# EasyEDA schematic loud-esp-rev-f-schematic.easyeda.json

## Sheets
1 MCU: TITLE: ESP32 audio development board; REV: F1; Date: 2023-04-20; Sheet: 1/5; Drawn By: andriy@sonocotta.com
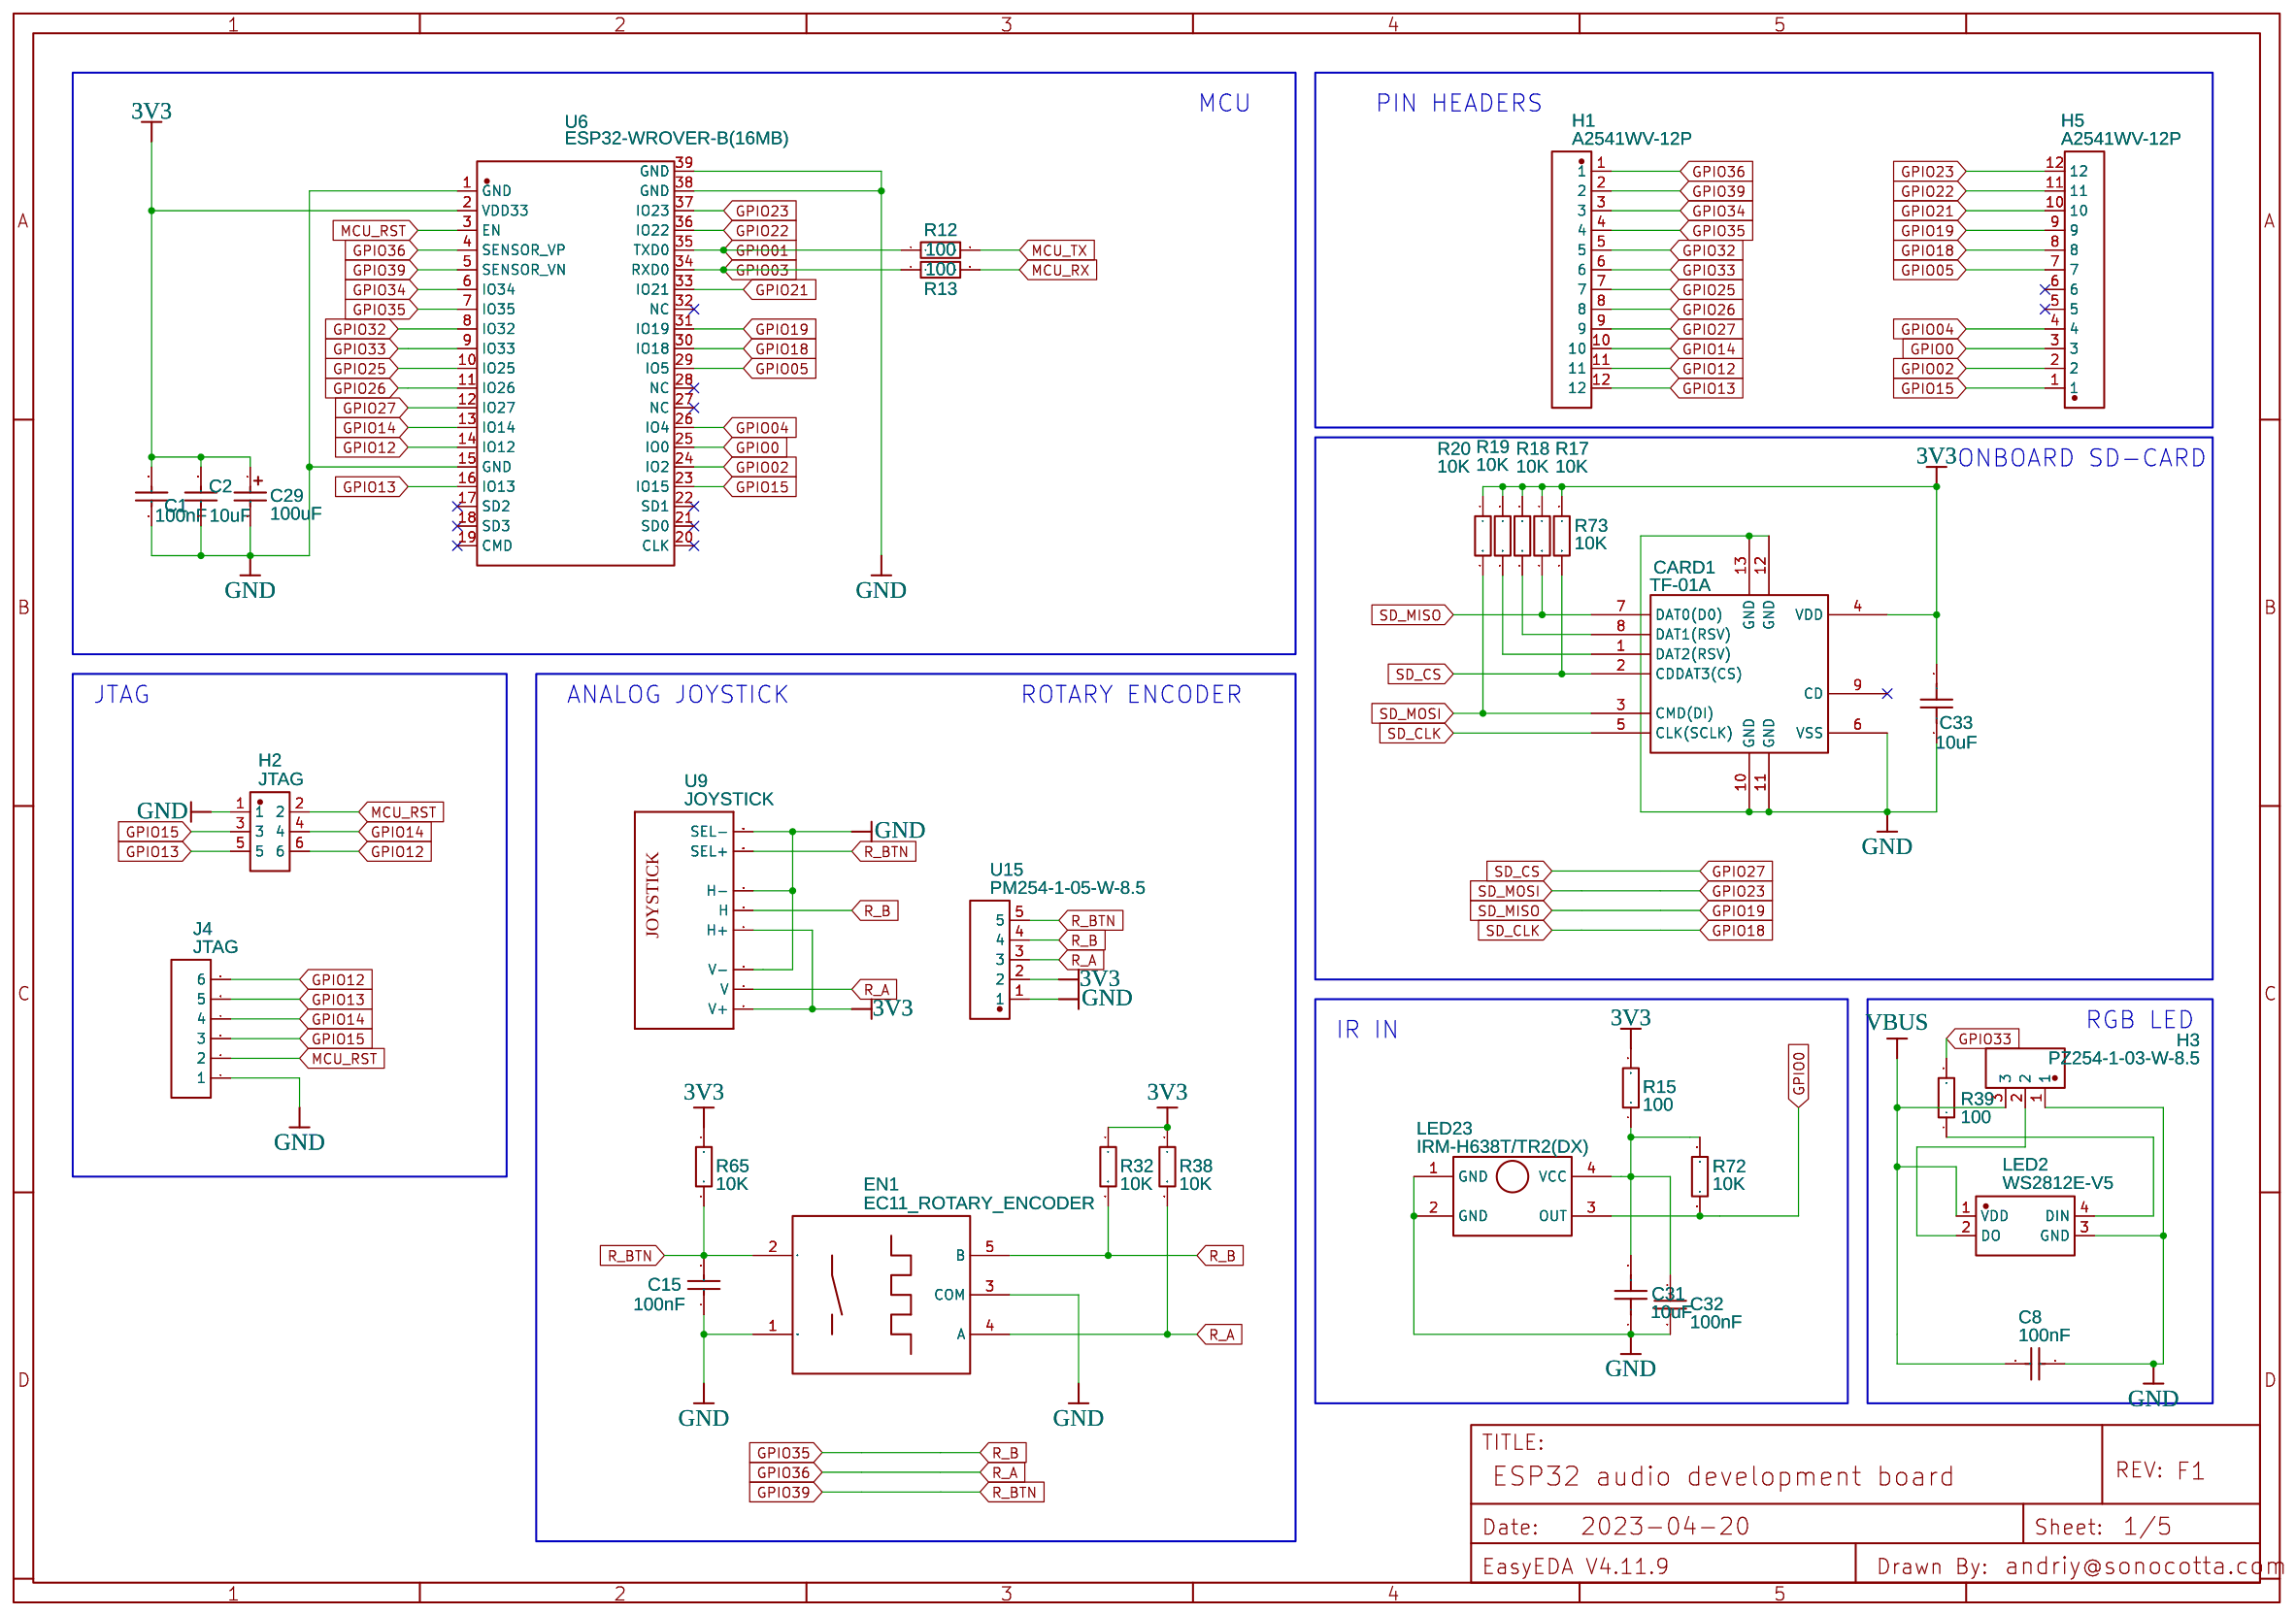
[diagram p0: MCU]
2 SERIAL: Sheet: 2/5; Company: Sonocotta
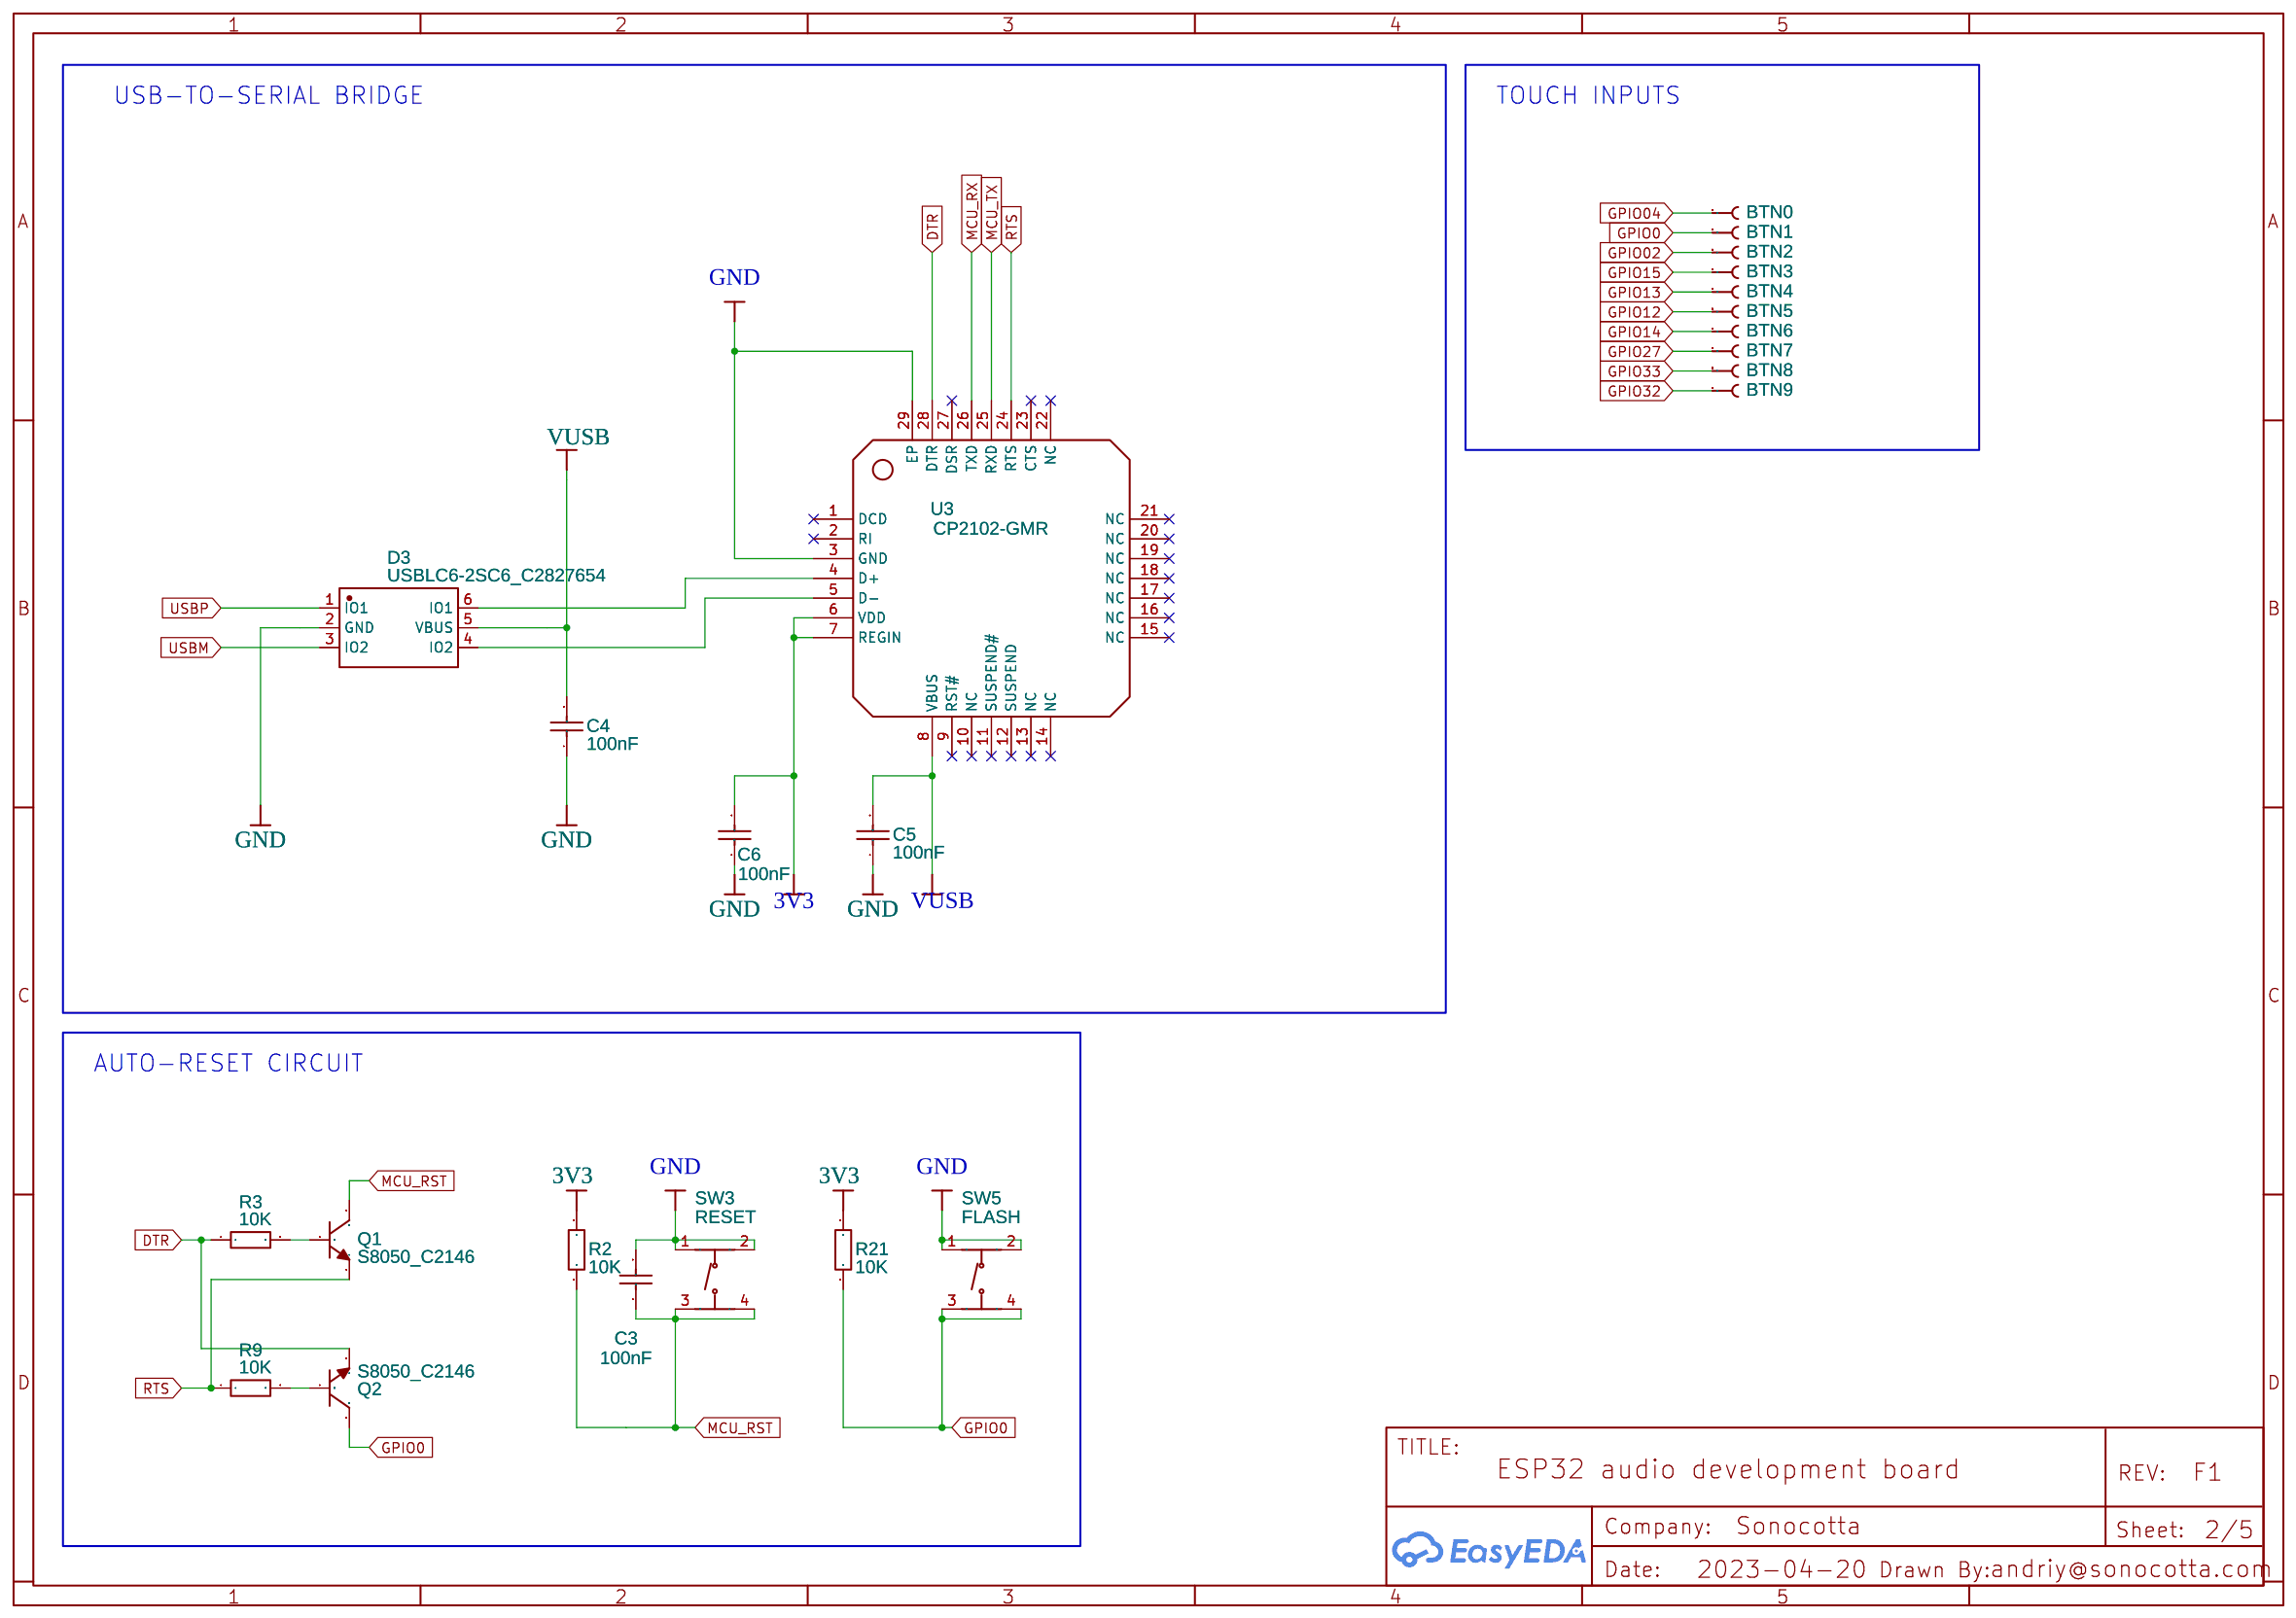
[diagram p1: SERIAL]
3 VISUAL: Sheet: 3/5; Company: Sonocotta
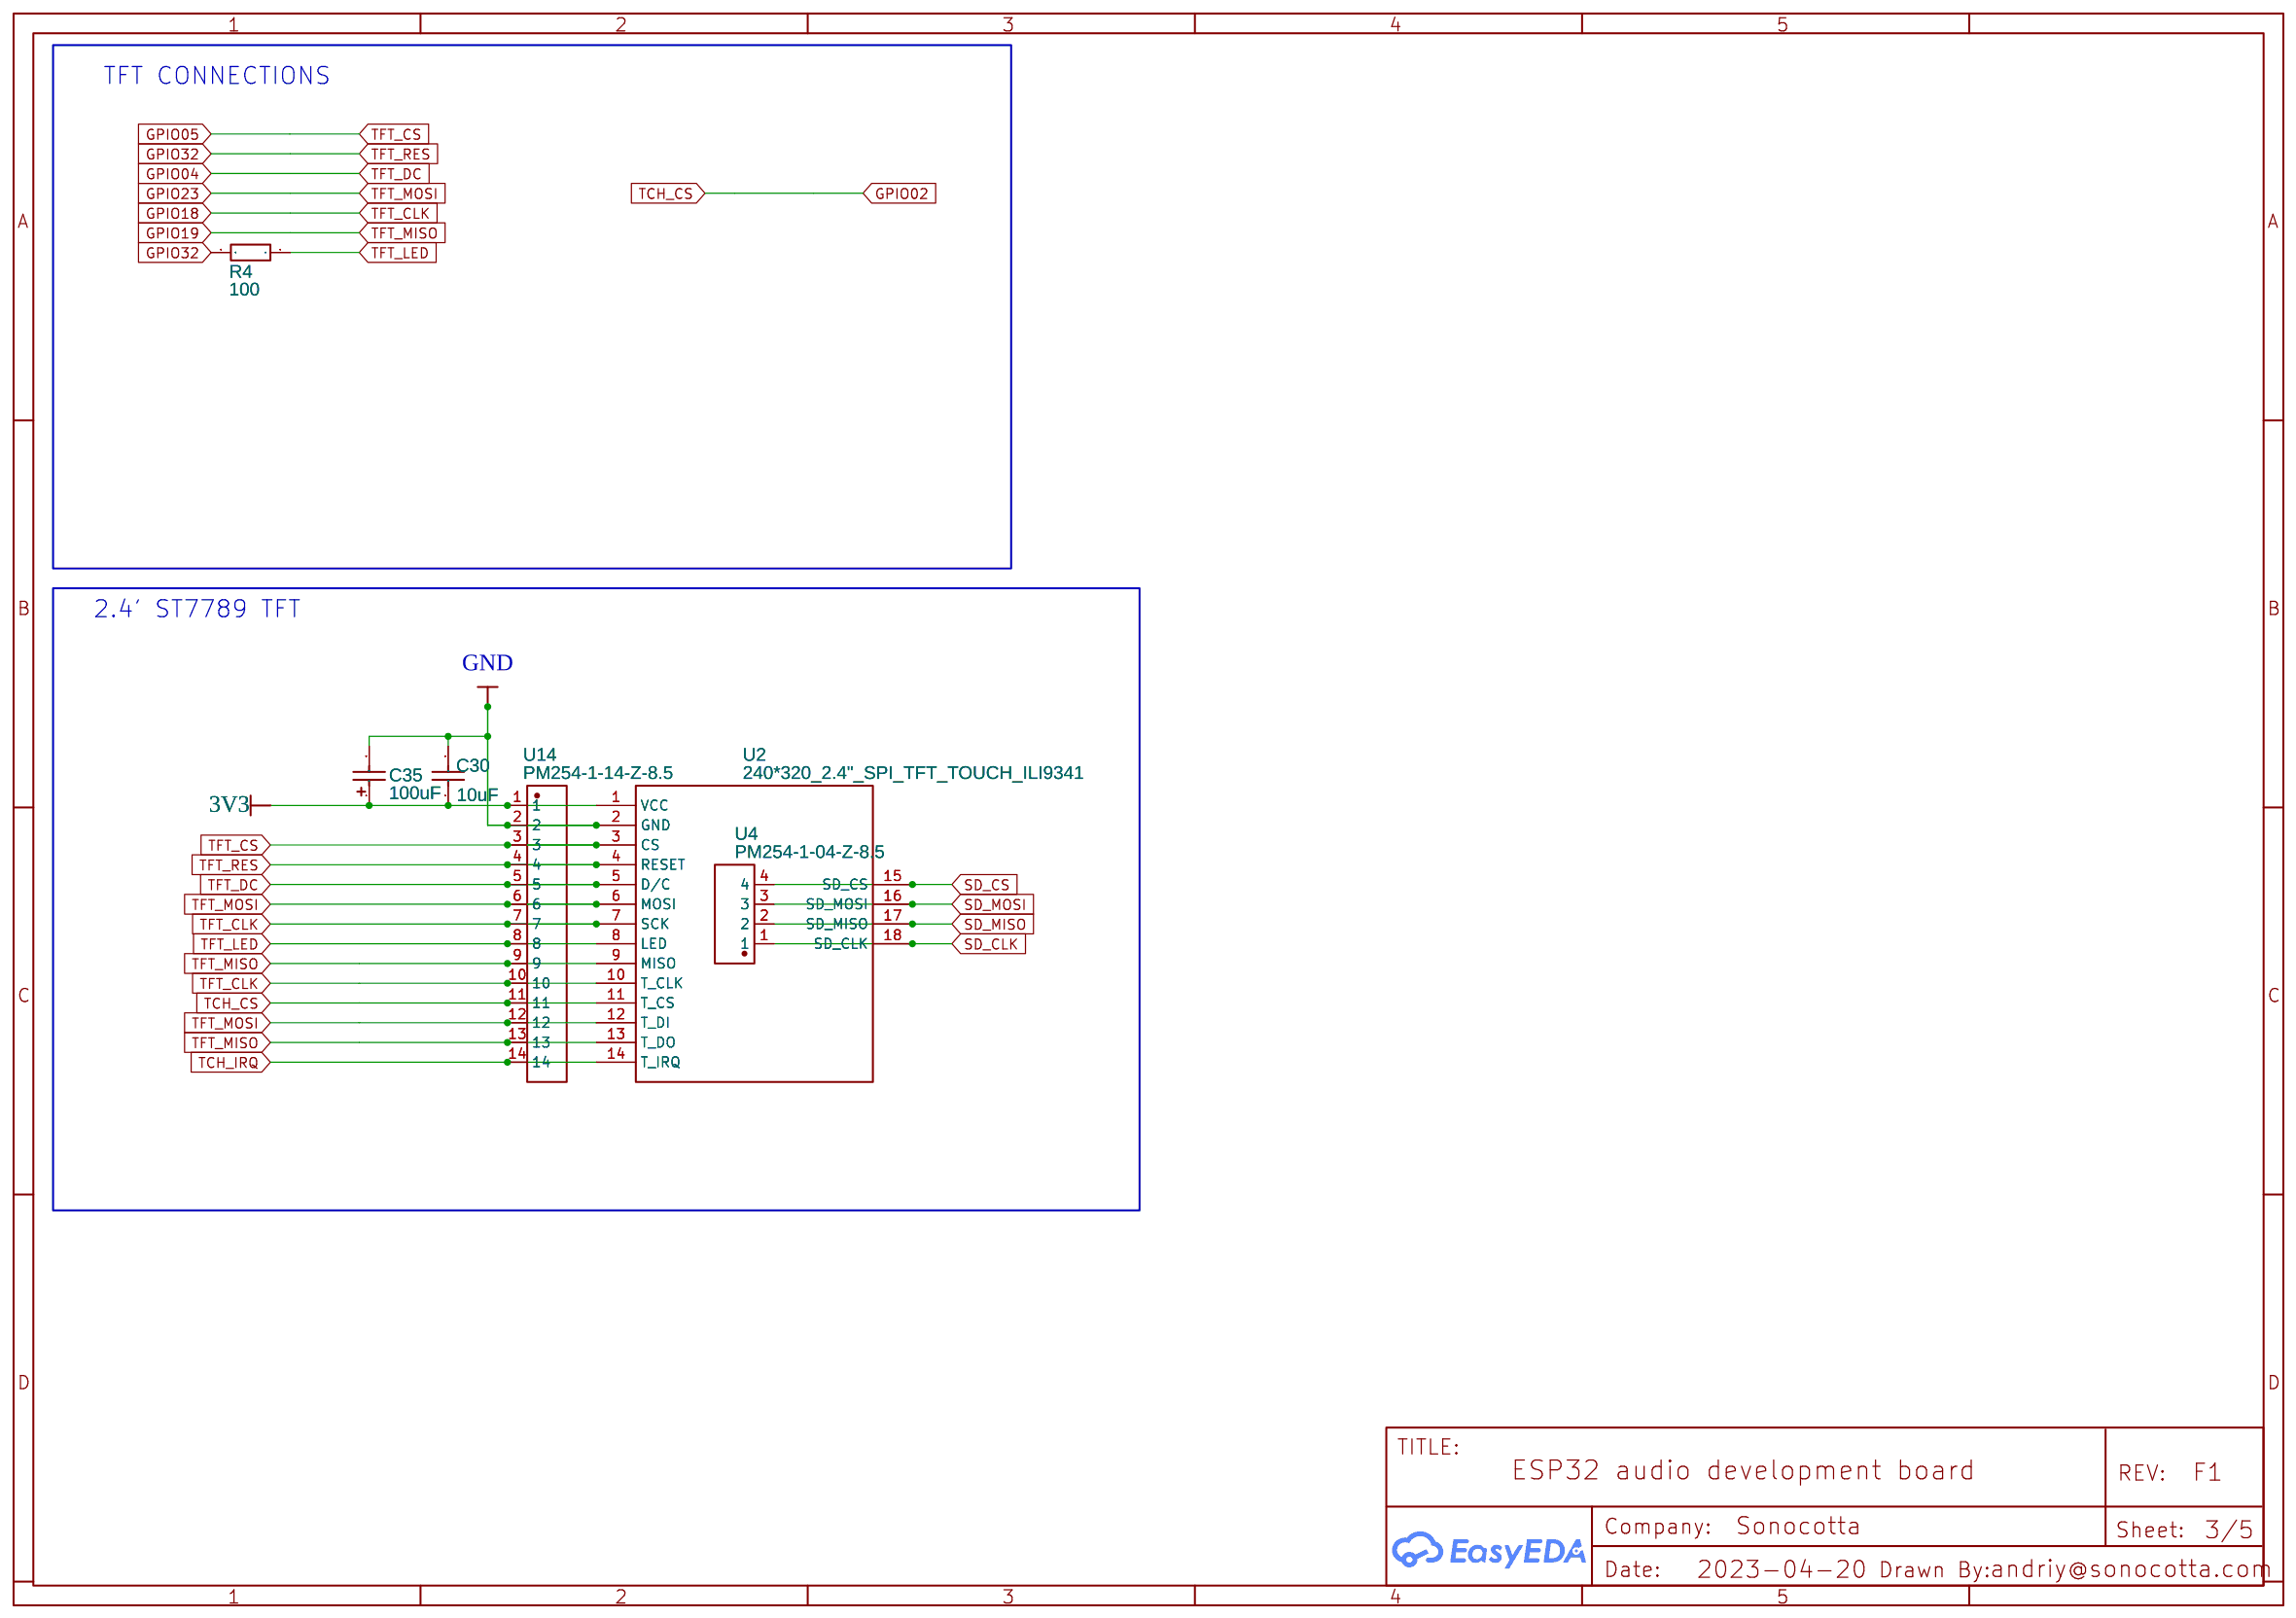
[diagram p2: VISUAL]
4 POWER MGT: Sheet: 4/5; Company: Sonocotta
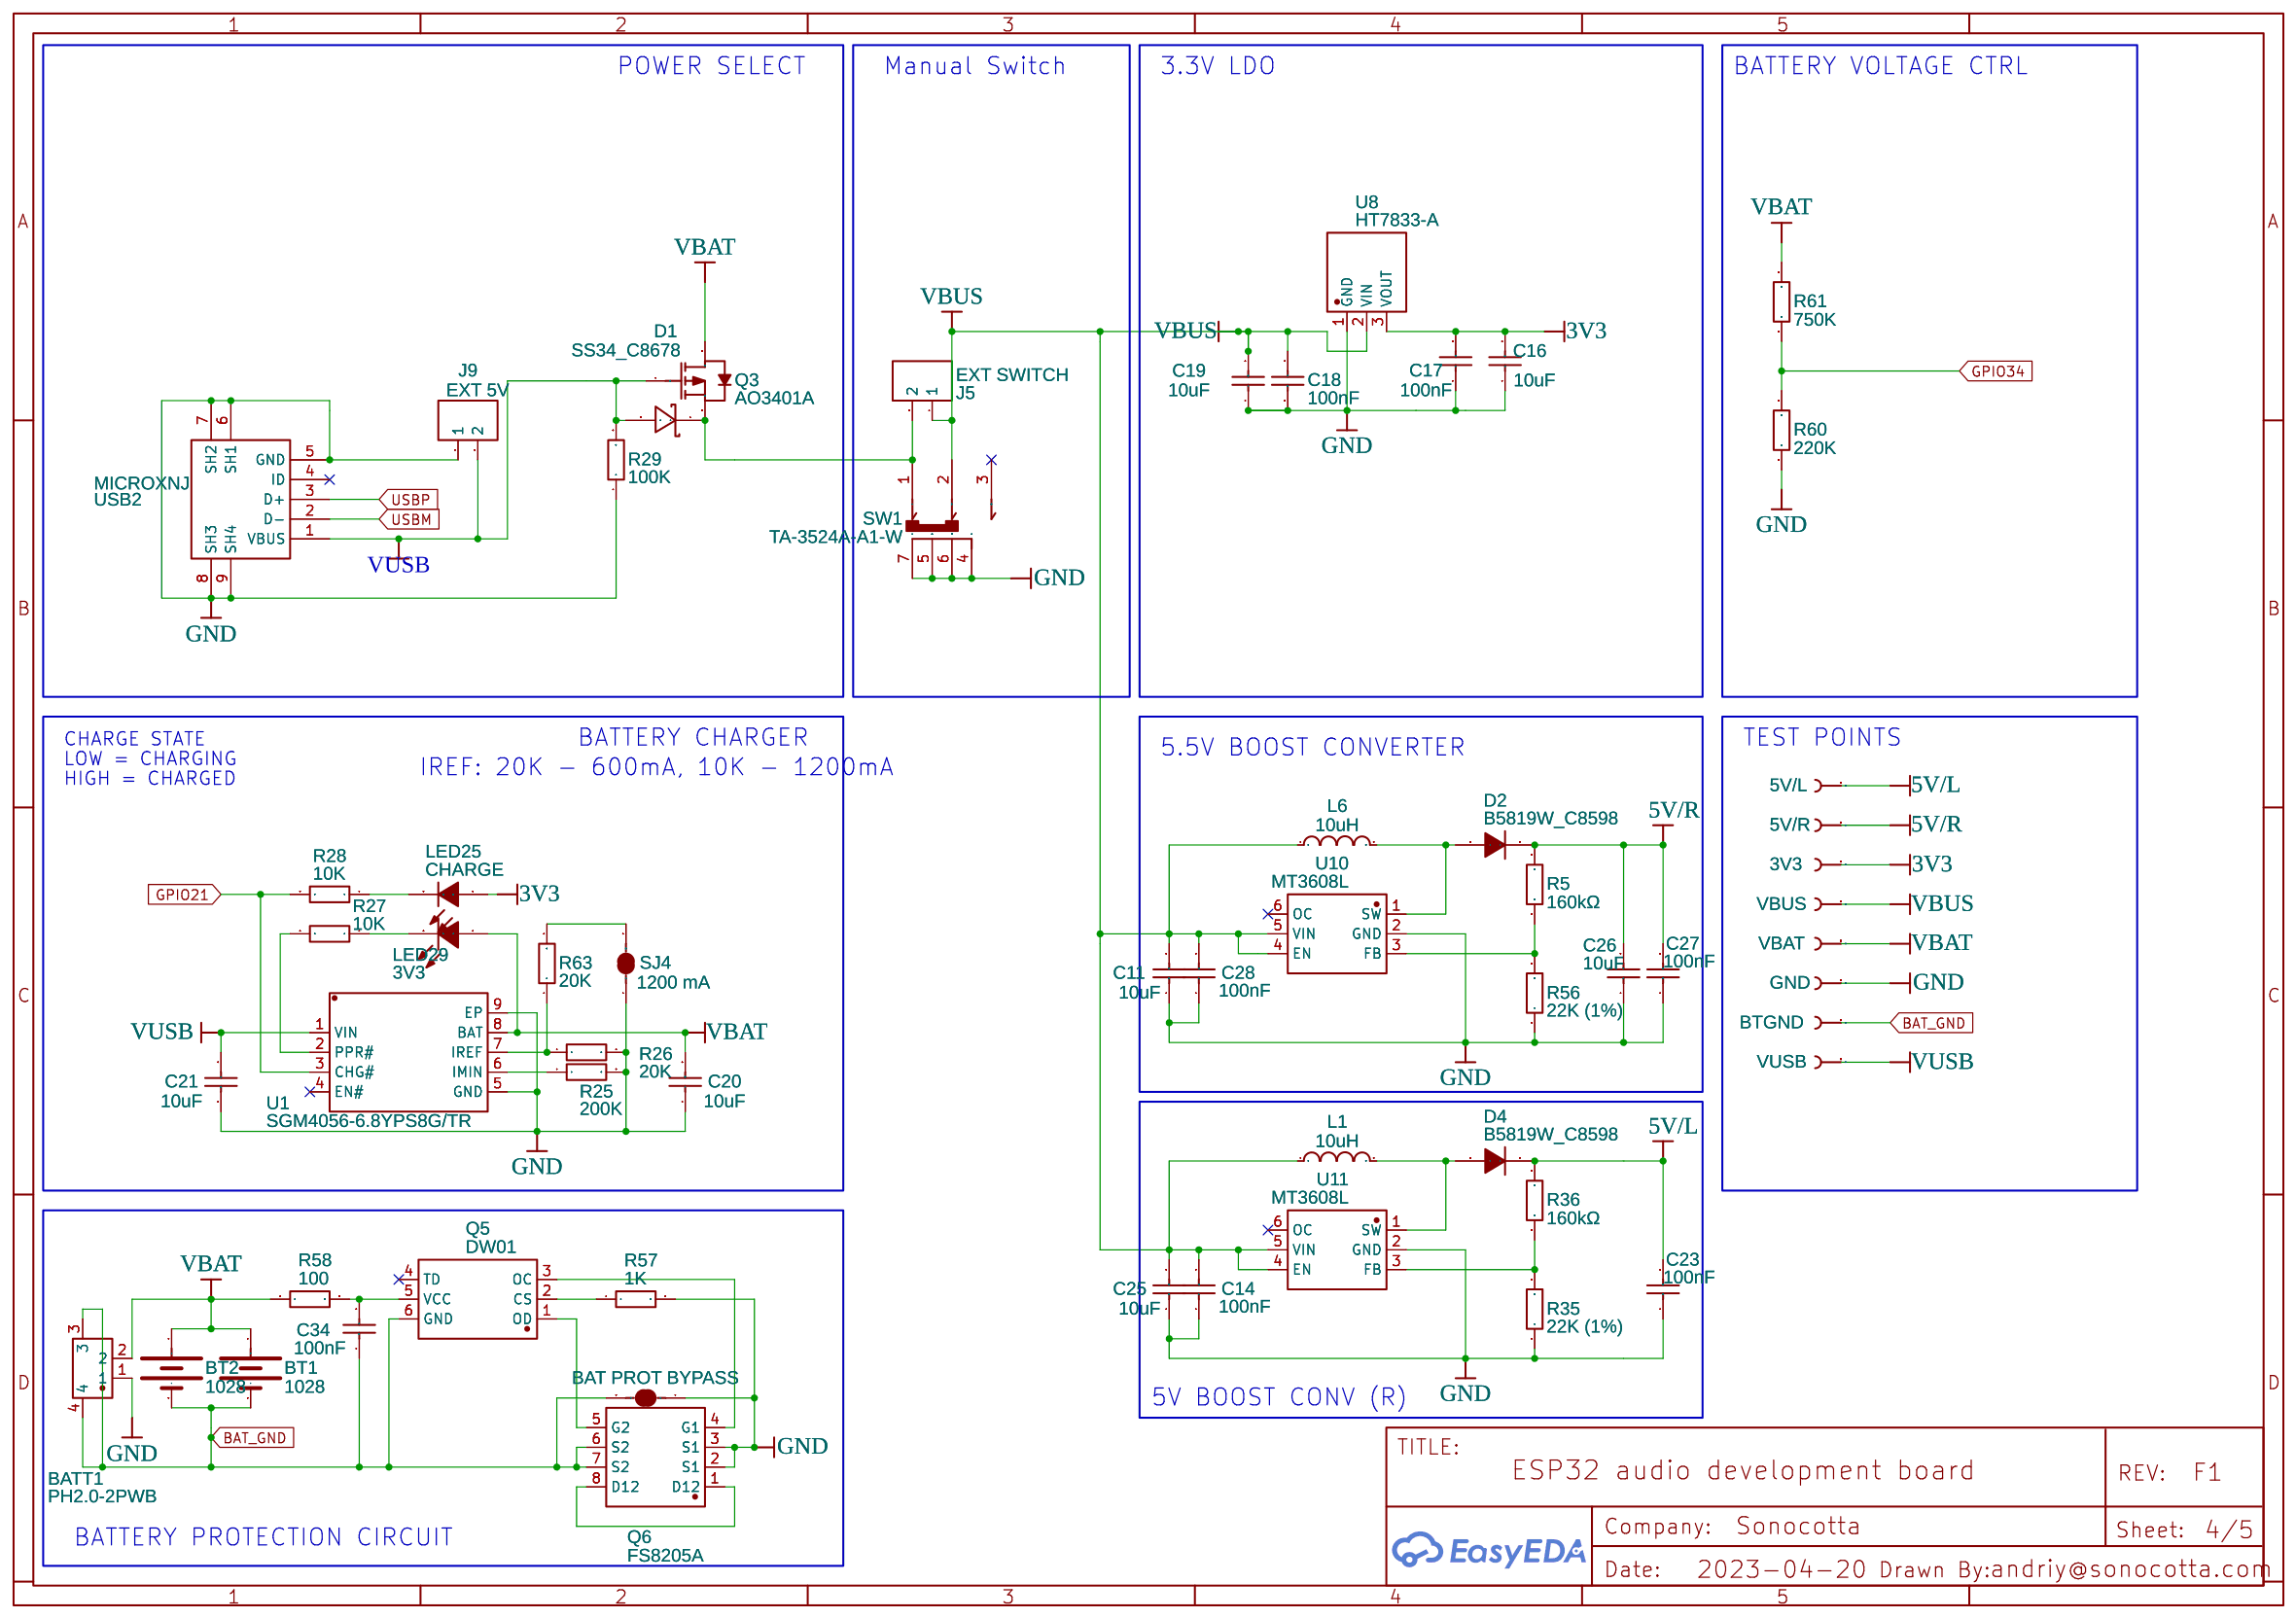
[diagram p3: POWER MGT]
5 DAC: Sheet: 5/5; Company: Sonocotta
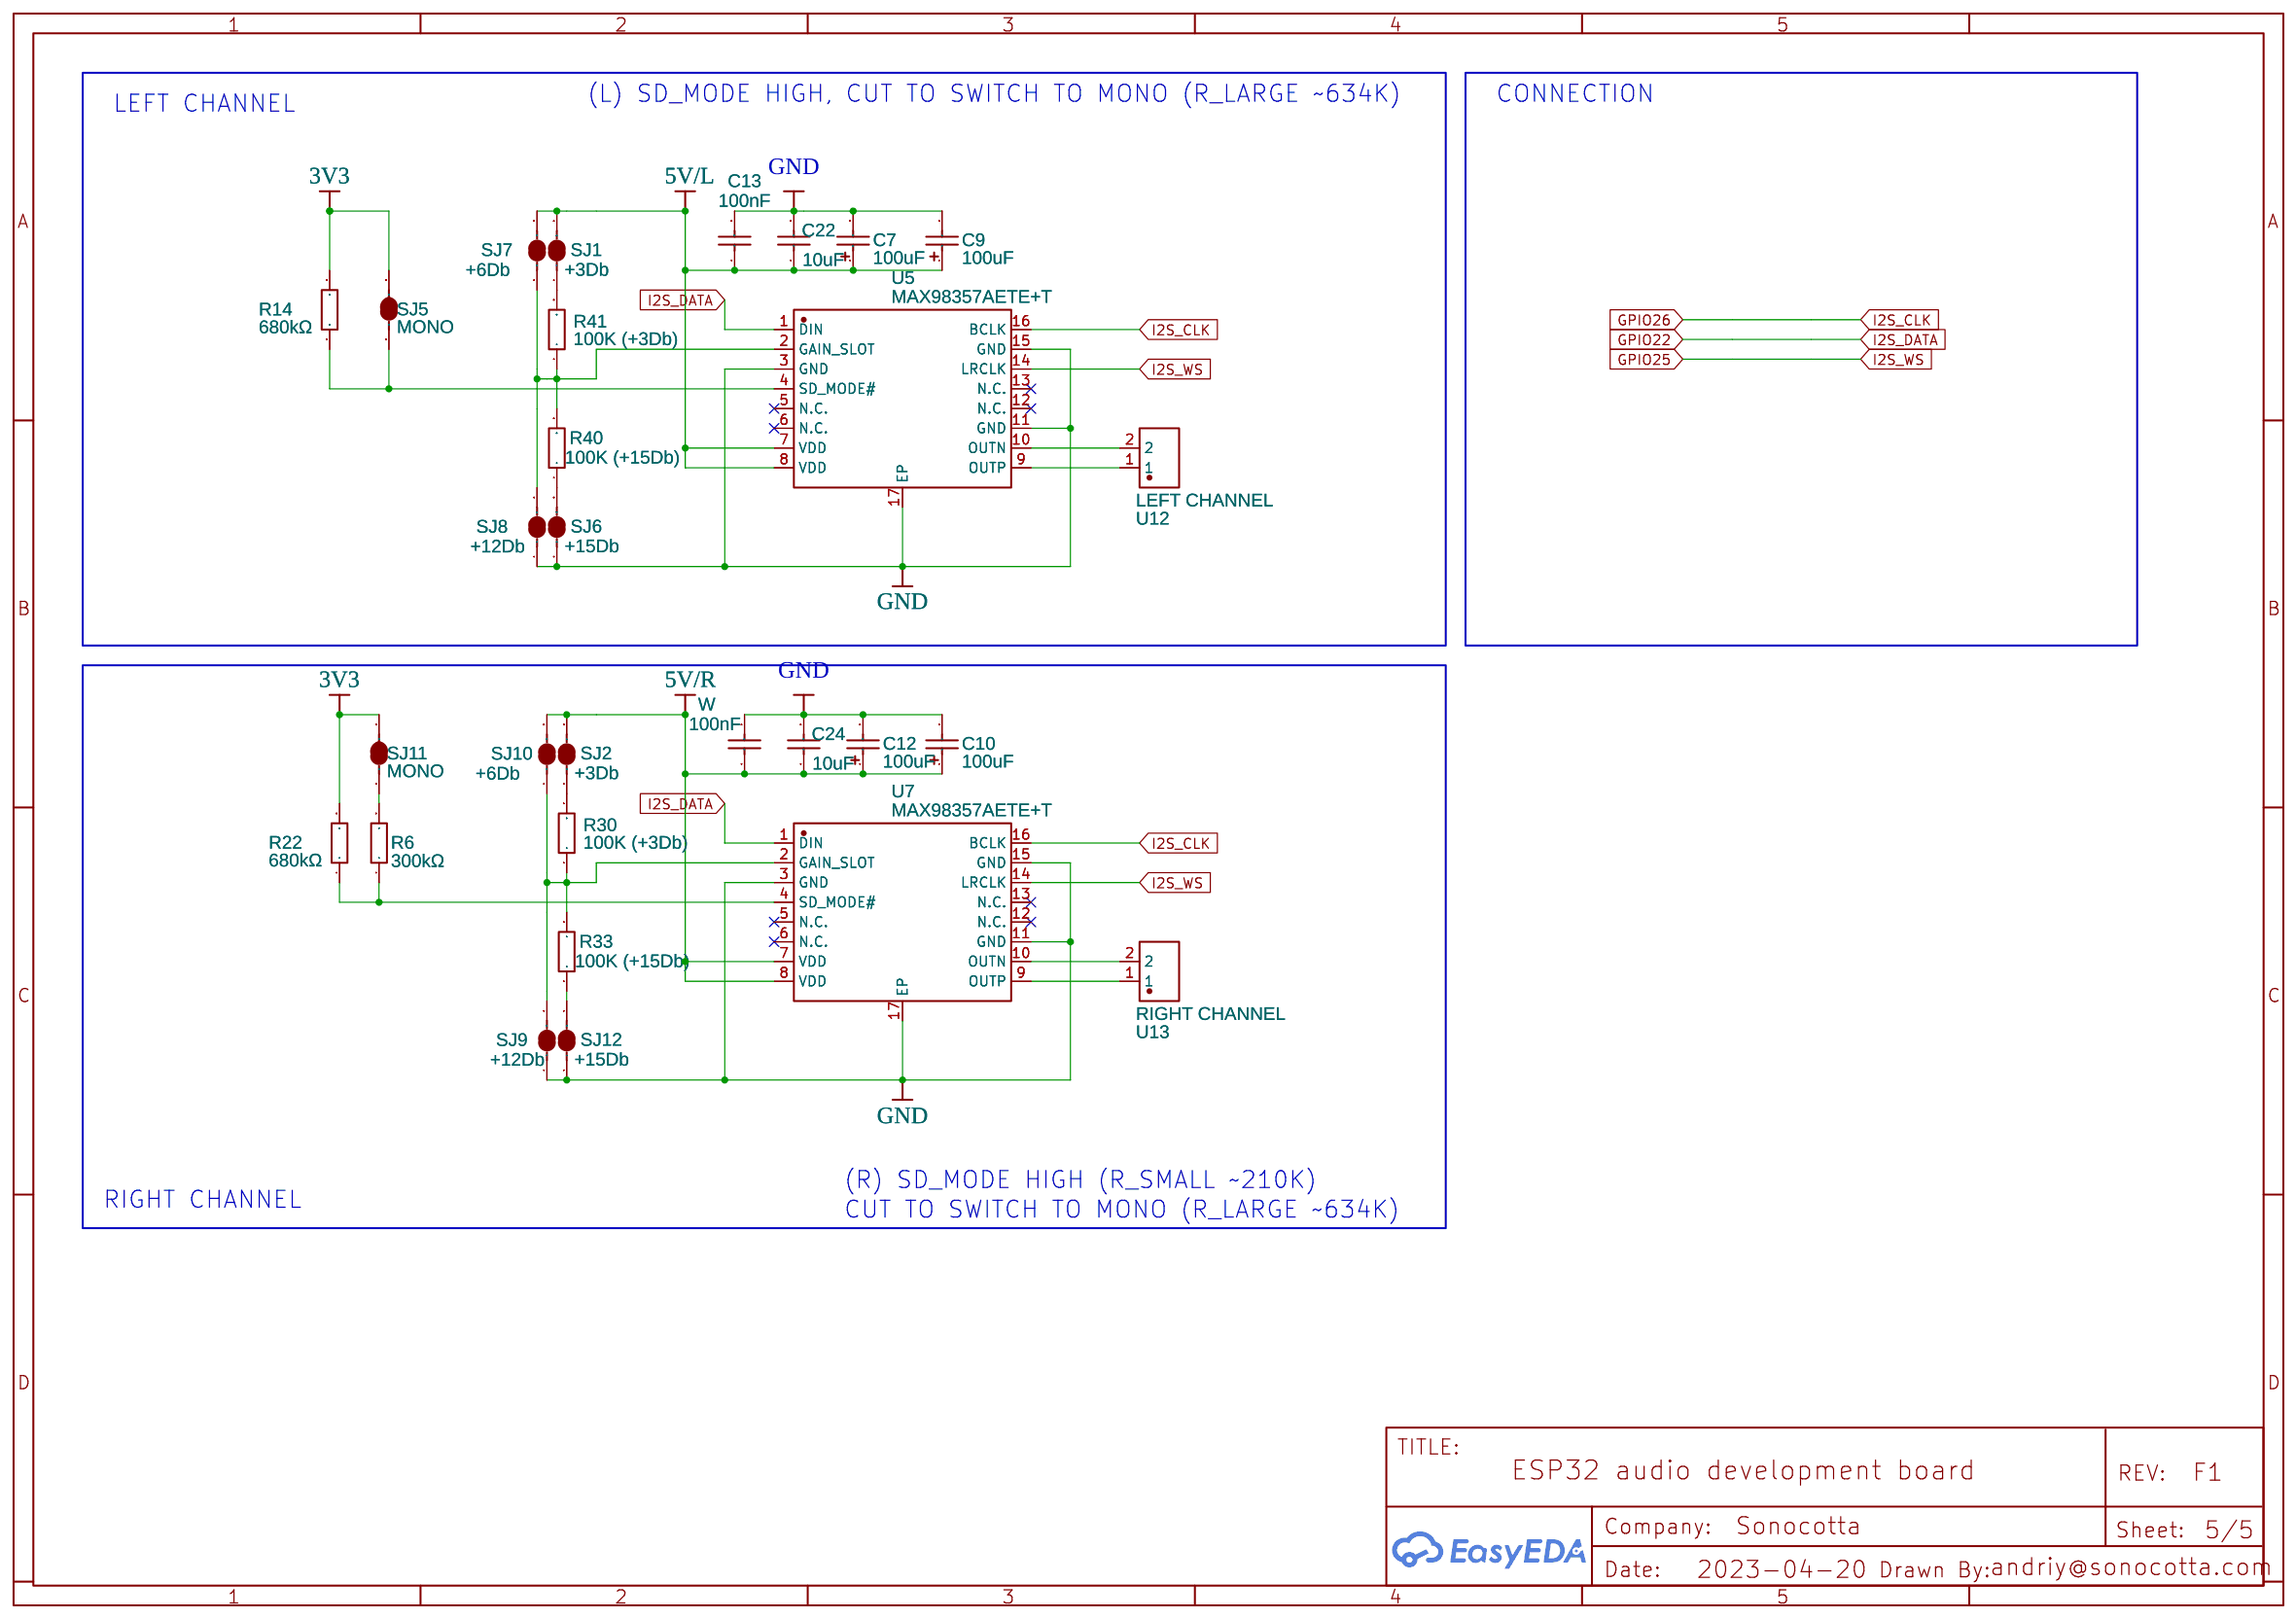
[diagram p4: DAC]

## Parts
sheet DAC
C7  100uF  [CAP-SMD_L3.5-W2.8]
C9  100uF  [CAP-SMD_L3.5-W2.8]
C10  100uF  [CAP-SMD_L3.5-W2.8]
C12  100uF  [CAP-SMD_L3.5-W2.8]
C13  100nF  [C0402]
C22  10uF  [C0805]
C24  10uF  [C0805]
R6  300kΩ  [R0402]
R14  680kΩ  [R0603]
R22  680kΩ  [R0603]
R30  100K (+3Db)  [R0402]
R33  100K (+15Db)  [R0402]
R40  100K (+15Db)  [R0402]
R41  100K (+3Db)  [R0402]
SJ1  +3Db  [PAD-JUMPER-2-NO_NO_SILK]
SJ2  +3Db  [PAD-JUMPER-2-NO_NO_SILK]
SJ5  MONO  [PAD-JUMPER-2-NC_BY_TRACE_NO_SILK]
SJ6  +15Db  [PAD-JUMPER-2-NO_NO_SILK]
SJ7  +6Db  [PAD-JUMPER-2-NO_NO_SILK]
SJ8  +12Db  [PAD-JUMPER-2-NO_NO_SILK]
SJ9  +12Db  [PAD-JUMPER-2-NO_NO_SILK]
SJ10  +6Db  [PAD-JUMPER-2-NO_NO_SILK]
SJ11  MONO  [PAD-JUMPER-2-NC_BY_TRACE_NO_SILK]
SJ12  +15Db  [PAD-JUMPER-2-NO_NO_SILK]
U5  MAX98357AETE+T  [TQFN-16_L3.0-W3.0-P0.50-BL-EP1.5]
U7  MAX98357AETE+T  [TQFN-16_L3.0-W3.0-P0.50-BL-EP1.5]
U12  LEFT CHANNEL  [CONN-TH_P3.50_KF350-3.5-2P]
U13  RIGHT CHANNEL  [CONN-TH_P3.50_KF350-3.5-2P]
W  100nF  [C0402]
sheet MCU
C1  100nF  [C0402]
C2  10uF  [C0805]
C8  100nF  [R0402]
C15  100nF  [C0402]
C29  100uF  [CAP-SMD_L3.5-W2.8]
C31  10uF  [C0603]
C32  100nF  [C0402]
C33  10uF  [C0603]
CARD1  TF-01A  [TF-SMD_TF-01A]
EN1  EC11_ROTARY_ENCODER  [ROTARY_ENCODER]
H1  A2541WV-12P  [HDR-TH_12P-P2.54-V-M]
H2  JTAG  [HDR-TH_6P-P2.00-V-M-R2-C3-S2.00]
H3  PZ254-1-03-W-8.5  [HDR-TH_03P-P2.54-H-M-W10.4-N]
H5  A2541WV-12P  [HDR-TH_12P-P2.54-V-M]
J4  JTAG  [HDR-M-2.54_1X6]
LED2  WS2812E-V5  [LED-SMD_4P-L5.0-W5.0-LS5.4-TL-1]
LED23  IRM-H638T/TR2(DX)  [SENSOR-SMD_IRM-H638T-TR2-DX]
R12  100  [R0402]
R13  100  [R0402]
R15  100  [R0402]
R17  10K  [R0402]
R18  10K  [R0402]
R19  10K  [R0402]
R20  10K  [R0402]
R32  10K  [R0402]
R38  10K  [R0402]
R39  100  [R0402]
R65  10K  [R0402]
R72  10K  [R0402]
R73  10K  [R0402]
U6  ESP32-WROVER-B(16MB)  [WIFIM-SMD_39P-L31.4-W18.0-P1.27]
U9  JOYSTICK  [JOYSTICK]
U15  PM254-1-05-W-8.5  [HDR-TH_5P-P2.54-H-F-W10.0-N]
sheet POWER MGT
3V3  SENSOR CAP 1  [PAD.02X.02]
5V/L  SENSOR CAP 1  [PAD.02X.02]
5V/R  SENSOR CAP 1  [PAD.02X.02]
BATT1  PH2.0-2PWB  [CONN-SMD_2P-P2.00_PH2.0-SPWB]
BT1  1028  [BAT-TH_KEYSTONE-1028-NO-SILK]
BT2  1028  [BAT-TH_KEYSTONE-1028-NO-SILK]
BTGND  SENSOR CAP 1  [PAD.02X.02]
C11  10uF  [C0805]
C14  100nF  [C0402]
C16  10uF  [C0805]
C17  100nF  [C0402]
C18  100nF  [C0402]
C19  10uF  [C0805]
C20  10uF  [C0805]
C21  10uF  [C0805]
C23  100nF  [C0402]
C25  10uF  [C0805]
C26  10uF  [C0805]
C27  100nF  [C0402]
C28  100nF  [C0402]
C34  100nF  [C0402]
D1  SS34_C8678  [DO-214AC_L4.3-W2.7-LS5.3-RD]
D2  B5819W_C8598  [SOD-123_L2.8-W1.8-LS3.7-RD]
D4  B5819W_C8598  [SOD-123_L2.8-W1.8-LS3.7-RD]
GND  SENSOR CAP 1  [PAD.02X.02]
J5  EXT SWITCH  [HDR-M-2.54_1X2]
J9  EXT 5V  [HDR-M-2.54_1X2]
L1  10uH  [IND-SMD_L7.0-W6.6]
L6  10uH  [IND-SMD_L7.0-W6.6]
LED25  CHARGE  [LED0603-R-RD]
LED29  3V3  [LED0603-R-RD]
Q3  AO3401A  [SOT-23_L2.9-W1.3-P1.90-LS2.4-BR]
Q5  DW01  [SOT-23-6_L2.9-W1.6-P0.95-LS2.8-BR]
Q6  FS8205A  [TSSOP-8_L4.4-W3.0-P0.65-LS6.4-BL-2]
R5  160kΩ  [R0603]
R25  200K  [R0402]
R26  20K  [R0402]
R27  10K  [R0402]
R28  10K  [R0402]
R29  100K  [R0402]
R35  22K (1%)  [R0603]
R36  160kΩ  [R0603]
R56  22K (1%)  [R0603]
R57  1K  [R0402]
R58  100  [R0402]
R60  220K  [R0603]
R61  750K  [R0603]
R63  20K  [R0402]
SJ3  BAT PROT BYPASS  [PAD-JUMPER-2-NO_NO_SILK]
SJ4  1200 mA  [PAD-JUMPER-2-NO_NO_SILK]
SW1  TA-3524A-A1-W  [CONN-TH_TA-3524A-A2]
U1  SGM4056-6.8YPS8G/TR  [SOIC-8_L4.9-W3.9-P1.27-LS6.0-BL-EP]
U8  HT7833-A  [SOT-89_L4.5-W2.5-P1.50-LS4.2-BR]
U10  MT3608L  [SOT-23-6_L2.9-W1.7-P0.95-LS2.8-BL]
U11  MT3608L  [SOT-23-6_L2.9-W1.7-P0.95-LS2.8-BL]
USB2  MICROXNJ  [MICRO-USB-SMD_MICROXNJ]
VBAT  SENSOR CAP 1  [PAD.02X.02]
VBUS  SENSOR CAP 1  [PAD.02X.02]
VUSB  SENSOR CAP 1  [PAD.02X.02]
sheet SERIAL
BTN0  SENSOR CAP 1  [PAD.02X.02]
BTN1  SENSOR CAP 1  [PAD.02X.02]
BTN2  SENSOR CAP 1  [PAD.02X.02]
BTN3  SENSOR CAP 1  [PAD.02X.02]
BTN4  SENSOR CAP 1  [PAD.02X.02]
BTN5  SENSOR CAP 1  [PAD.02X.02]
BTN6  SENSOR CAP 1  [PAD.02X.02]
BTN7  SENSOR CAP 1  [PAD.02X.02]
BTN8  SENSOR CAP 1  [PAD.02X.02]
BTN9  SENSOR CAP 1  [PAD.02X.02]
C3  100nF  [C0402]
C4  100nF  [C0402]
C5  100nF  [C0402]
C6  100nF  [C0402]
D3  USBLC6-2SC6_C2827654  [SOT-23-6_L2.9-W1.6-P0.95-LS2.8-BL]
Q1  S8050_C2146  [SOT-23-3_L3.0-W1.7-P0.95-LS2.9-BR]
Q2  S8050_C2146  [SOT-23-3_L3.0-W1.7-P0.95-LS2.9-BR]
R2  10K  [R0402]
R3  10K  [R0402]
R9  10K  [R0402]
R21  10K  [R0402]
SW3  RESET  [SW-SMD_4P-L5.1-W5.1-P3.70-LS6.5-TL-2]
SW5  FLASH  [SW-SMD_4P-L5.1-W5.1-P3.70-LS6.5-TL-2]
U3  CP2102-GMR  [QFN-28_L5.0-W5.0-P0.50-BL-EP]
sheet VISUAL
C30  10uF  [C0805]
C35  100uF  [CAP-SMD_L3.5-W2.8]
R4  100  [R0402]
U2  240*320_2.4"_SPI_TFT_TOUCH_ILI9341  [2.4_TFT_TS]
U4  PM254-1-04-Z-8.5  [HDR-TH_4P-P2.54-V-F]
U14  PM254-1-14-Z-8.5  [HDR-TH_14P-P2.54-V-F-1]

## Library data of the parts
C7 C9 C10 C12 C29 C35 = TAJB107K006RNJ: Supplier: LCSC; Manufacturer: AVX; Supplier Part: C16133; JLCPCB Part Class: Basic Part
C1 C3-C6 C13-C15 C17 C18 C23 C27 C28 C32 C34 W = CL05B104KO5NNNC: Supplier: LCSC; Manufacturer: SAMSUNG; Supplier Part: C1525; SMT Type: Basic; JLCPCB SMD: Yes; LCSC Assembly: Yes; Paste Type: base
C2 C11 C16 C19-C22 C24-C26 C30 = CL21A106KAYNNNE: Supplier: LCSC; Manufacturer: SAMSUNG; Supplier Part: C15850; SMT Type: Basic; JLCPCB SMD: Yes; LCSC Assembly: Yes; Paste Type: base
R6 = 0402WGF3003TCE: Supplier: LCSC; Manufacturer: UNI-ROYAL(厚声); Supplier Part: C25774; Resistance (Ohms): 300K; JLCPCB Part Class: Basic Part
R14 R22 = 0603WAF6803T5E: Supplier: LCSC; Manufacturer: UNI-ROYAL(厚声); Supplier Part: C25822; Resistance (Ohms): 680K; JLCPCB Part Class: Basic Part
R29 R30 R33 R40 R41 = 0402WGF1003TCE: Supplier: LCSC; Manufacturer: UniOhm; Supplier Part: C25741; JLCPCB Part Class: Basic Part
SJ1-SJ4 SJ6-SJ10 SJ12 = JUMPER-PAD-2-NO: Contributor: SparkFun
SJ5 SJ11 = JUMPER-PAD-2-NC_BY_TRACENO_SILK: Contributor: SparkFun
U5 U7 = MAX98357AETE+T: Supplier: LCSC; Supplier Part: C910544; Manufacturer: MAXIM(美信); Contributor: LCSC; JLCPCB Part Class: Extended Part
U12 U13 = KF350-3.5-2P: Supplier: LCSC; Supplier Part: C474892; Manufacturer: Cixi Kefa Elec; Contributor: LCSC; JLCPCB Part Class: Extended Part
C8 = C0201X6S104K6R3NTA: Supplier: LCSC; Supplier Part: C1525; Manufacturer: SAMSUNG; Manufacturer Part: CL05B104KO5NNNC; Contributor: LCSC
C31 C33 = JMK107ABJ106KA-T: Supplier: LCSC; Supplier Part: C19702; Manufacturer: SAMSUNG; Manufacturer Part: CL10A106KP8NNNC; Contributor: LCSC
CARD1 = TF-01A: Supplier: LCSC; Manufacturer: HRO; Supplier Part: C91145; JLCPCB Part Class: Extended Part
EN1 = EC11_ROTARY_ENCODER: Manufacturer Part: EC11 Rotary Encoder; Contributor: Martin Green
H1 H5 = A2541WV-12P: Supplier: LCSC; Supplier Part: C225487; Manufacturer: Changjiang Connectors; Contributor: LCSC; JLCPCB Part Class: Extended Part
H2 = X4621WV-2×03I-C28D40: Supplier: LCSC; Supplier Part: C706986; Manufacturer: XKB Connectivity; Contributor: LCSC; JLCPCB Part Class: Extended Part
H3 = PZ254-1-03-W-8.5: Supplier: LCSC; Supplier Part: C2894945; Manufacturer: HCTL(华灿天禄); Contributor: LCSC; JLCPCB Part Class: Extended Part
J4 = HDR-M-2.54_1x6: Supplier Part: C190819; Supplier: LCSC; Contributor: LCEDA_Lib
LED2 = WS2812E-V5: Supplier: LCSC; Supplier Part: C2920042; Manufacturer: worldsemi; JLCPCB Part Class: Extended Part; Contributor: lcsc
LED23 = IRM-H638T/TR2(DX): Supplier: LCSC; Supplier Part: C390031; Manufacturer: Everlight Elec; Contributor: LCSC; JLCPCB Part Class: Extended Part
R4 R12 R13 R15 R39 R58 = 0402WGF1000TCE: Supplier: LCSC; Manufacturer: UniOhm; Supplier Part: C25076; JLCPCB Part Class: Basic Part
R2 R3 R9 R17-R21 R27 R28 R32 R38 R65 R72 R73 = 0402WGF1002TCE: Supplier: LCSC; Manufacturer: UniOhm; Supplier Part: C25744; SMT Type: Basic; JLCPCB SMD: Yes; LCSC Assembly: Yes; Paste Type: base
U6 = ESP32-WROVER-B(16MB): Supplier: LCSC; Supplier Part: C529590; Manufacturer: Espressif Systems; Contributor: LCSC; JLCPCB Part Class: Extended Part
U9 = JOYSTICK: Contributor: SparkFun
U15 = PM254-1-05-W-8.5: Supplier: LCSC; Supplier Part: C2897387; Manufacturer: HCTL(华灿天禄); Contributor: LCSC; JLCPCB Part Class: Extended Part
3V3 5V/L 5V/R BTGND BTN0-BTN9 GND VBAT VBUS VUSB = TEST-POINT2: Bare copper test points for troubleshooting or ICT; Contributor: SparkFun
BATT1 = PH2.0-2PWB: Supplier: LCSC; Manufacturer: BOOMELE; Manufacturer Part: PH2.0-2PWB Horizontal; Supplier Part: C47647; JLCPCB Part Class: Extended Part
BT1 BT2 = 1028: Supplier: LCSC; Supplier Part: C238063; Manufacturer: Keystone; Contributor: LCSC; JLCPCB Part Class: Extended Part
D1 = SS34_C8678: Supplier: LCSC; Manufacturer Part: SS34; Manufacturer: MDD; Supplier Part: C8678; JLCPCB Part Class: Basic Part
D2 D4 = B5819W_C8598: Supplier: LCSC; Manufacturer: CJ; Manufacturer Part: B5819W; image: //image.lceda.cn/szlcsc/C8598.jpg; Supplier Part: C8598; SMT Type: Basic; JLCPCB SMD: Yes; LCSC Assembly: Yes; Paste Type: base
J5 J9 = HDR-M-2.54_1x2: Supplier Part: C124375; Supplier: LCSC; Contributor: LCEDA_Lib
L1 L6 = FXL0630-100-M: Supplier: LCSC; Manufacturer: cjiang; Contributor: LCSC; Supplier Part: C167223; JLCPCB Part Class: Extended Part
LED25 = 19-217/GHC-YR1S2/3T: Supplier: LCSC; Manufacturer: EVERLIGHT; Supplier Part: C72043; JLCPCB Part Class: Basic Part
LED29 = KT-0603R: Supplier: LCSC; Manufacturer: KENTO; image: //image.lceda.cn/szlcsc/C2286.jpg; Supplier Part: C2286; SMT Type: Basic; JLCPCB SMD: Yes; LCSC Assembly: Yes; Paste Type: base
Q3 = AO3401A: Supplier: LCSC; Manufacturer: AOS; Supplier Part: C15127; JLCPCB Part Class: Basic Part
Q5 = DW01: Supplier: LCSC; Manufacturer: Hottech; Contributor: LCSC; Supplier Part: C181096; JLCPCB Part Class: Extended Part
Q6 = FS8205A: Supplier: LCSC; Manufacturer: FORTUNE; Supplier Part: C16052; JLCPCB Part Class: Basic Part
R5 R36 = 0603WAF1603T5E: Supplier: LCSC; Manufacturer: UNI-ROYAL(厚声); Supplier Part: C22813; Resistance (Ohms): 160K; JLCPCB Part Class: Basic Part
R25 = 0402WGF2003TCE: Supplier: LCSC; Manufacturer: UniOhm; Supplier Part: C25764; JLCPCB Part Class: Basic Part
R26 R63 = 0402WGF2002TCE: Supplier: LCSC; Manufacturer: UniOhm; Supplier Part: C25765; JLCPCB Part Class: Basic Part
R35 R56 = 0603WAF2202T5E: Supplier: LCSC; Manufacturer: UniOhm; Supplier Part: C31850; JLCPCB Part Class: Basic Part
R57 = 0402WGF1001TCE: Supplier: LCSC; Manufacturer: UniOhm; Supplier Part: C11702; JLCPCB Part Class: Basic Part
R60 = 0603WAF2203T5E: Supplier: LCSC; Manufacturer: UniOhm; Supplier Part: C22961; JLCPCB Part Class: Basic Part
R61 = 0603WAF7503T5E: Supplier: LCSC; Manufacturer: UniOhm; Supplier Part: C23240; JLCPCB Part Class: Basic Part
SW1 = TA-3524A-A1-W: Supplier: LCSC; Supplier Part: C730329; Manufacturer: Yuandi(元迪); Contributor: LCSC; JLCPCB Part Class: Extended Part
U1 = SGM4056-6.8YPS8G/TR: Supplier: LCSC; Manufacturer: SGMICRO; Supplier Part: C79687; JLCPCB Part Class: Extended Part
U8 = HT7833-A: Supplier: LCSC; Supplier Part: C347195; Manufacturer: UMW(Youtai Semiconductor Co., Ltd.); Contributor: LCSC; JLCPCB Part Class: Extended Part
U10 U11 = MT3608L: Supplier: LCSC; Supplier Part: C2932326; Manufacturer: 西安航天民芯; Contributor: LCSC; JLCPCB Part Class: Extended Part
USB2 = MICROXNJ: Supplier: LCSC; Supplier Part: C404969; Manufacturer: SHOU HAN; Manufacturer Part: MicroXNJ; Contributor: LCSC; Paste Type: expand
D3 = USBLC6-2SC6_C2827654: Supplier: LCSC; Supplier Part: C2827654; Manufacturer: TECH PUBLIC(台舟电子); Manufacturer Part: USBLC6-2SC6; Contributor: LCSC
Q1 Q2 = S8050_C2146: Supplier: LCSC; Manufacturer: CJ; Manufacturer Part: S8050; Supplier Part: C2146; JLCPCB Part Class: Basic Part
SW3 SW5 = TS-1187A-B-A-B: Supplier: LCSC; Supplier Part: C318884; Manufacturer: XKB Enterprise; Contributor: LCSC; JLCPCB Part Class: Extended Part
U3 = CP2102-GMR: Supplier: LCSC; Manufacturer: SILICON LABS; Supplier Part: C6568; JLCPCB Part Class: Basic Part
U2 = 240*320_2.4"_SPI_TFT_TOUCH_ILI9341: Contributor: tonydc
U4 = PM254-1-04-Z-8.5: Supplier: LCSC; Supplier Part: C2897367; Manufacturer: HCTL(华灿天禄); Contributor: LCSC; JLCPCB Part Class: Extended Part
U14 = PM254-1-14-Z-8.5: Supplier: LCSC; Supplier Part: C2897377; Manufacturer: HCTL(华灿天禄); Contributor: LCSC; JLCPCB Part Class: Extended Part

## Nets
3V3: 3V3.P$1(1) C1.2 C2.2 C6.2 C16.2 C17.2 C29.1 C30.1 C33.2 C35.1 CARD1.4(VDD) LED25.1(A) R2.1 R14.2 R15.2 R17.1 R18.1 R19.1 R20.1 R21.1 R22.2 R32.1 R38.1 R65.1 R73.1 SJ5.2 SJ11.2 U2.1(VCC) U3.6(VDD) U3.7(REGIN) U6.2(VDD33) U8.3(VOUT) U9.H1(H+) U9.V1(V+) U14.1 U15.2
GND: BATT1.1 C1.1 C2.1 C3.2 C4.1 C5.1 C6.1 C7.2 C8.2 C9.2 C10.2 C11.1 C12.2 C13.2 C14.1 C15.1 C16.1 C17.1 C18.1 C19.1 C20.1 C21.1 C22.2 C23.1 C24.2 C25.1 C26.1 C27.1 C28.1 C29.2 C30.2 C31.1 C32.2 C33.1 C35.2 CARD1.6(VSS) CARD1.10(GND) CARD1.11(GND) CARD1.12(GND) CARD1.13(GND) D3.2(GND) EN1.1(SWA) EN1.3(COM) GND.P$1(1) H2.1 H3.1 J4.1 J9.1 LED2.3(GND) LED23.1(GND) LED23.2(GND) Q6.2(S1) Q6.3(S1) R25.2 R26.2 R29.1 R35.1 R56.1 R57.2 R60.1 SJ3.1 SJ4.1 SJ6.1 SJ8.1 SJ9.1 SJ12.1 SW1.4 SW1.5 SW1.6 SW1.7 SW3.1(A) SW3.2(B) SW5.1(A) SW5.2(B) U1.5(GND) U1.9(EP) U2.2(GND) U3.3(GND) U3.29(EP) U5.3(GND) U5.11(GND) U5.15(GND) U5.17(EP) U6.1(GND) U6.15(GND) U6.38(GND) U6.39(GND) U7.3(GND) U7.11(GND) U7.15(GND) U7.17(EP) U8.1(GND) U9.B2A(SEL-) U9.H3(H-) U9.V3(V-) U10.2(GND) U11.2(GND) U14.2 U15.1 USB2.5(GND) USB2.6(SH1) USB2.7(SH2) USB2.8(SH3) USB2.9(SH4) W.2
VBAT: BATT1.2 BT1.1(+) BT2.1(+) C20.2 LED29.1(A) Q3.3(D) R58.1 R61.2 U1.8(BAT) VBAT.P$1(1)
VBUS: C8.1 C11.2 C14.2 C18.2 C19.2 C25.2 C28.2 H3.3 J5.1 L1.1 L6.1 LED2.1(VDD) SW1.2 U8.2(VIN) U10.4(EN) U10.5(VIN) U11.4(EN) U11.5(VIN) VBUS.P$1(1)
5V/L: 5V/L.P$1(1) C7.1 C9.1 C13.1 C22.1 C23.2 D4.1(-) R36.2 SJ1.2 SJ7.2 U5.7(VDD) U5.8(VDD)
5V/R: 5V/R.P$1(1) C10.1 C12.1 C24.1 C26.2 C27.2 D2.1(-) R5.2 SJ2.2 SJ10.2 U7.7(VDD) U7.8(VDD) W.1
BAT_GND: BATT1.3 BATT1.4 BT1.2(-) BT2.2(-) BTGND.P$1(1) C34.1 Q5.6(GND) Q6.6(S2) Q6.7(S2) SJ3.2
DTR: Q2.2(E) R3.1 U3.28(DTR)
GPIO0: BTN1.P$1(1) H5.3 LED23.3(OUT) Q2.3(C) R21.2 R72.2 SW5.3(C) SW5.4(D) U6.25(IO0)
GPIO01: R12.1 U6.35(TXD0)
GPIO02: BTN2.P$1(1) H5.2 U2.11(T_CS) U6.24(IO2) U14.11
GPIO03: R13.1 U6.34(RXD0)
GPIO04: BTN0.P$1(1) H5.4 U2.5(D/C) U6.26(IO4) U14.5
GPIO05: H5.7 U2.3(CS) U6.29(IO5) U14.3
GPIO12: BTN5.P$1(1) H1.11 H2.6 J4.6 U6.14(IO12)
GPIO13: BTN4.P$1(1) H1.12 H2.5 J4.5 U6.16(IO13)
GPIO14: BTN6.P$1(1) H1.10 H2.4 J4.4 U6.13(IO14)
GPIO15: BTN3.P$1(1) H2.3 H5.1 J4.3 U6.23(IO15)
GPIO18: CARD1.5(CLK(SCLK)) H5.8 U2.7(SCK) U2.10(T_CLK) U2.18(SD_CLK) U4.1 U6.30(IO18) U14.7 U14.10
GPIO19: CARD1.7(DAT0(D0)) H5.9 R17.2 U2.9(MISO) U2.13(T_DO) U2.17(SD_MISO) U4.2 U6.31(IO19) U14.9 U14.13
GPIO21: H5.10 R28.2 U1.3(CHG#) U6.33(IO21)
GPIO22: H5.11 U5.1(DIN) U6.36(IO22) U7.1(DIN)
GPIO23: CARD1.3(CMD(DI)) H5.12 R20.2 U2.6(MOSI) U2.12(T_DI) U2.16(SD_MOSI) U4.3 U6.37(IO23) U14.6 U14.12
GPIO25: H1.7 U5.14(LRCLK) U6.10(IO25) U7.14(LRCLK)
GPIO26: H1.8 U5.16(BCLK) U6.11(IO26) U7.16(BCLK)
GPIO27: BTN7.P$1(1) CARD1.2(CDDAT3(CS)) H1.9 R73.2 U2.15(SD_CS) U4.4 U6.12(IO27)
GPIO32: BTN9.P$1(1) H1.5 R4.2 U2.4(RESET) U6.8(IO32) U14.4
GPIO33: BTN8.P$1(1) H1.6 R39.2 U6.9(IO33)
GPIO34: H1.3 R60.2 R61.1 U6.6(IO34)
GPIO35: EN1.5(B) H1.4 R32.2 U6.7(IO35) U9.H2(H) U15.4
GPIO36: EN1.4(A) H1.1 R38.2 U6.4(SENSOR_VP) U9.V2(V) U15.3
GPIO39: C15.2 EN1.2 H1.2 R65.2 U6.5(SENSOR_VN) U9.B1A(SEL+) U15.5
MCU_RST: C3.1 H2.2 J4.2 Q1.3(C) R2.2 SW3.3(C) SW3.4(D) U6.3(EN)
MCU_RX: R13.2 U3.26(TXD)
MCU_TX: R12.2 U3.25(RXD)
RTS: Q1.2(E) R9.1 U3.24(RTS)
TCH_IRQ: U2.14(T_IRQ) U14.14
TFT_LED: R4.1 U2.8(LED) U14.8
USBM: D3.3(IO2) USB2.2(D-)
USBP: D3.1(IO1) USB2.3(D+)
VUSB: C4.2 C5.2 C21.2 D1.2(A) D3.5(VBUS) J9.2 Q3.1(G) R29.2 U1.1(VIN) U3.8(VBUS) USB2.1(VBUS) VUSB.P$1(1)
Net-(C31-2): C31.2 C32.1 LED23.4(VCC) R15.1 R72.1
Net-(C34-2): C34.2 Q5.5(VCC) R58.2
Net-(CARD1-1): CARD1.1(DAT2(RSV)) R19.2
Net-(CARD1-8): CARD1.8(DAT1(RSV)) R18.2
Net-(D1-1): D1.1(K) J5.2 Q3.2(S) SW1.1
Net-(D2-2): D2.2(+) L6.2 U10.1(SW)
Net-(D3-4): D3.4(IO2) U3.5(D-)
Net-(D3-6): D3.6(IO1) U3.4(D+)
Net-(D4-2): D4.2(+) L1.2 U11.1(SW)
Net-(H3-2): H3.2 LED2.2(DO)
Net-(LED2-4): LED2.4(DIN) R39.1
Net-(LED25-2): LED25.2(C) R28.1
Net-(LED29-2): LED29.2(K) R27.1
Net-(Q1-1): Q1.1(B) R3.2
Net-(Q2-1): Q2.1(B) R9.2
Net-(Q5-1): Q5.1(OD) Q6.5(G2)
Net-(Q5-2): Q5.2(CS) R57.1
Net-(Q5-3): Q5.3(OC) Q6.4(G1)
Net-(Q6-1): Q6.1(D12) Q6.8(D12)
Net-(R5-1): R5.1 R56.2 U10.3(FB)
Net-(R6-1): R6.1 R22.1 U7.4(SD_MODE#)
Net-(R6-2): R6.2 SJ11.1
Net-(R14-1): R14.1 SJ5.1 U5.4(SD_MODE#)
Net-(R25-1): R25.1 U1.6(IMIN)
Net-(R26-1): R26.1 R63.1 U1.7(IREF)
Net-(R27-2): R27.2 U1.2(PPR#)
Net-(R30-1): R30.1 R33.2 SJ9.2 SJ10.1 U7.2(GAIN_SLOT)
Net-(R30-2): R30.2 SJ2.1
Net-(R33-1): R33.1 SJ12.2
Net-(R35-2): R35.2 R36.1 U11.3(FB)
Net-(R40-1): R40.1 SJ6.2
Net-(R40-2): R40.2 R41.1 SJ7.1 SJ8.2 U5.2(GAIN_SLOT)
Net-(R41-2): R41.2 SJ1.1
Net-(R63-2): R63.2 SJ4.2
Net-(U5-9): U5.9(OUTP) U12.1
Net-(U5-10): U5.10(OUTN) U12.2
Net-(U7-9): U7.9(OUTP) U13.1
Net-(U7-10): U7.10(OUTN) U13.2

Not connected (* = marked no-connect by the designer): CARD1 9(CD)*; H5 5* 6*; Q5 4(TD)*; SW1 3*; U1 4(EN#)*; U3 1(DCD)* 2(RI)* 9(RST#)* 10(NC)* 11(SUSPEND#)* 12(SUSPEND)* 13(NC)* 14(NC)* 15(NC)* 16(NC)* 17(NC)* 18(NC)* 19(NC)* 20(NC)* 21(NC)* 22(NC)* 23(CTS)* 27(DSR)*; U5 5(N.C.)* 6(N.C.)* 12(N.C.)* 13(N.C.)*; U6 17(SD2)* 18(SD3)* 19(CMD)* 20(CLK)* 21(SD0)* 22(SD1)* 27(NC)* 28(NC)* 32(NC)*; U7 5(N.C.)* 6(N.C.)* 12(N.C.)* 13(N.C.)*; U10 6(OC)*; U11 6(OC)*; USB2 4(ID)*

## Notes on the sheets
sheet 1
- MCU
- PIN HEADERS
- ONBOARD SD-CARD
- JTAG
- ANALOG JOYSTICK
- ROTARY ENCODER
- IR IN
- RGB LED
sheet 2
- USB-TO-SERIAL BRIDGE
- TOUCH INPUTS
- AUTO-RESET CIRCUIT
sheet 3
- TFT CONNECTIONS
- 2.4' ST7789 TFT
sheet 4
- POWER SELECT
- Manual Switch
- 3.3V LDO
- BATTERY VOLTAGE CTRL
- CHARGE STATE
- BATTERY CHARGER
- 5.5V BOOST CONVERTER
- TEST POINTS
- HIGH = CHARGED
- LOW = CHARGING
- IREF: 20K - 600mA, 10K - 1200mA
- 5V BOOST CONV (R)
- BATTERY PROTECTION CIRCUIT
sheet 5
- (L) SD_MODE HIGH, CUT TO SWITCH TO MONO (R_LARGE ~634K)
- CONNECTION
- LEFT CHANNEL
- RIGHT CHANNEL
- (R) SD_MODE HIGH (R_SMALL ~210K)
- CUT TO SWITCH TO MONO (R_LARGE ~634K)
